# EAGLE design CubieBoardVGABreakout (EAGLE 6.5.0)
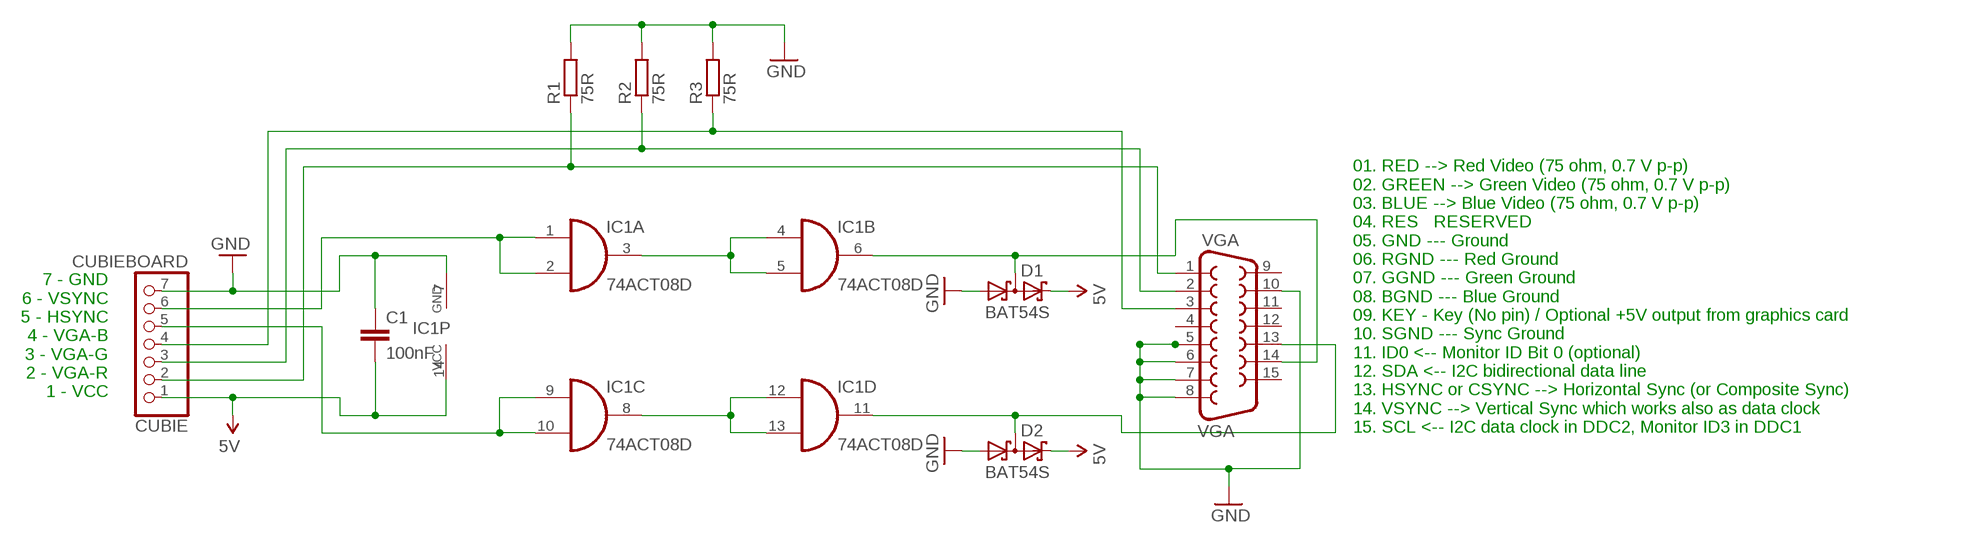
[diagram p0: schematic, sheet 1]

## Parts
C1  100nF  CAP0805  [0805]
CUBIE  CUBIEBOARD  PINHD-1X7  [1X07]
D1  BAT54S  [SOT23]
D2  BAT54S  [SOT23]
IC1  74ACT08D  [SO14]
R1  75R  R-EU_0204/2V  [0204V]
R2  75R  R-EU_0204/2V  [0204V]
R3  75R  R-EU_0204/2V  [0204V]
VGA  VGA  F15HDH  [HDF15H]

## Nets
5V: C1.2 CUBIE.1 D1.2(C2) D2.2(C2) IC1.14(P:VCC)
GND: C1.1 CUBIE.7 D1.1(A1) D2.1(A1) IC1.7(P:GND) R1.2 R2.2 R3.2 VGA.5 VGA.6 VGA.7 VGA.8 VGA.10
N$3: CUBIE.6 IC1.1(A:I0) IC1.2(A:I1)
N$4: CUBIE.5 IC1.9(C:I0) IC1.10(C:I1)
N$5: IC1.3(A:O) IC1.4(B:I0) IC1.5(B:I1)
N$6: IC1.8(C:O) IC1.12(D:I0) IC1.13(D:I1)
N$9: D2.3(C1A2) IC1.11(D:O) VGA.13
N$10: D1.3(C1A2) IC1.6(B:O) VGA.14
VGA-B: CUBIE.4 R3.1 VGA.3
VGA-G: CUBIE.3 R2.1 VGA.2
VGA-R: CUBIE.2 R1.1 VGA.1
Unconnected: VGA.4 VGA.9 VGA.11 VGA.12 VGA.15

## Notes on the sheet
- 7 - GND
  6 - VSYNC
  5 - HSYNC
  4 - VGA-B
  3 - VGA-G
  2 - VGA-R
  1 - VCC
- 01. RED --> Red Video (75 ohm, 0.7 V p-p)
  02. GREEN --> Green Video (75 ohm, 0.7 V p-p)
  03. BLUE --> Blue Video (75 ohm, 0.7 V p-p)
  04. RES   RESERVED
  05. GND --- Ground
  06. RGND --- Red Ground
  07. GGND --- Green Ground
  08. BGND --- Blue Ground
  09. KEY - Key (No pin) / Optional +5V output from graphics card
  10. SGND --- Sync Ground
  11. ID0 <-- Monitor ID Bit 0 (optional)
  12. SDA <-- I2C bidirectional data line 
  13. HSYNC or CSYNC --> Horizontal Sync (or Composite Sync)
  14. VSYNC --> Vertical Sync which works also as data clock
  15. SCL <-- I2C data clock in DDC2, Monitor ID3 in DDC1

## Library data of the parts
C1 = SparkFun-Passives:CAP: Capacitor Standard 0603 ceramic capacitor, and 0.1" leaded capacitor.
CUBIE = pinhead:PINHD-1X7: PIN HEADER
D1 D2 = diode:BAT54S: Schottky Diodes Pin connection corrected 2011-05-04 Source: Fairchild .. BAT54.pdf
IC1 = 74xx-eu:74*08: Quad 2-input AND gate
R1-R3 = resistor:R-EU_: RESISTOR, European symbol
VGA = con-subd:F15: SUB-D; OC_FARNELL: unknown; OC_NEWARK: unknown

## Net classes
0 default: clearance 0.205 mm

## Board
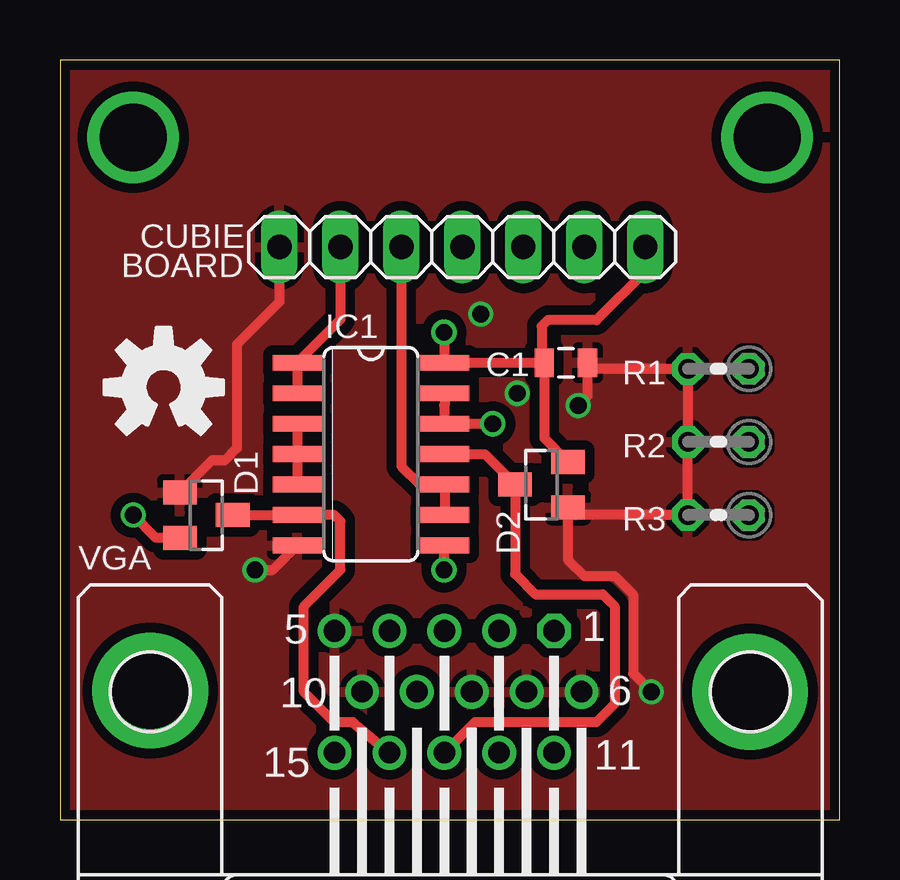
[diagram p1: board, top side]
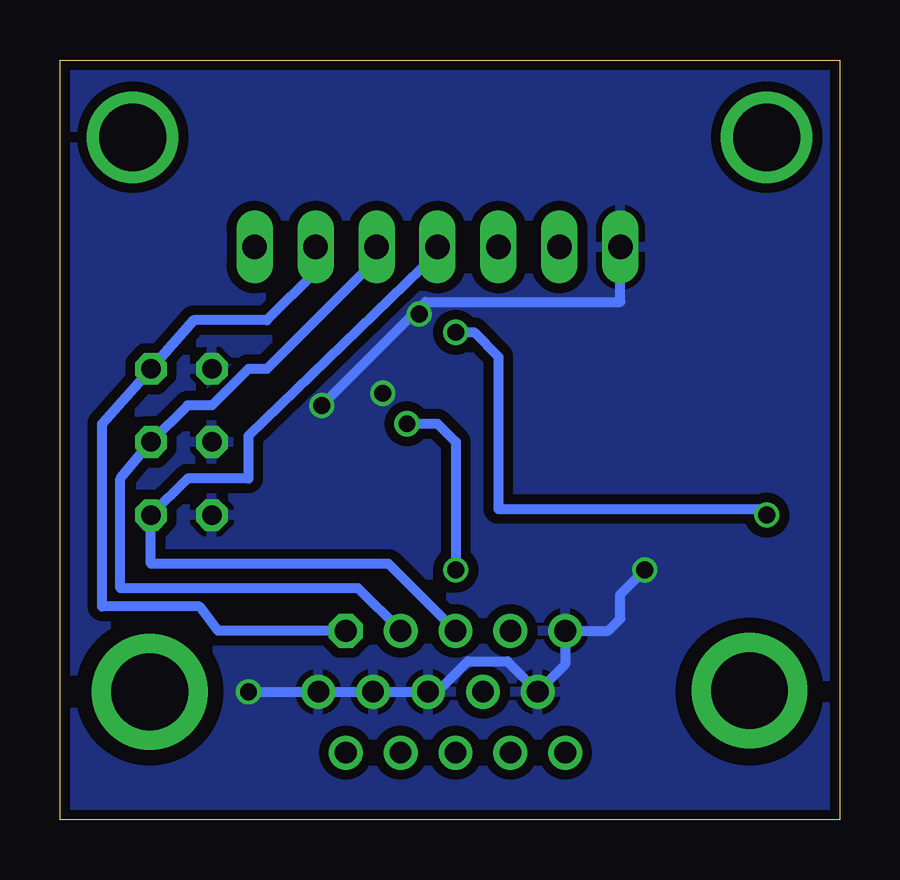
[diagram p2: board, bottom side, seen from below]

Size 32.49 x 31.67 mm. Coordinates in mm from the lower left corner, seen from the top.
Outline: 0,0 32.49,0 32.49,31.67 0,31.67 0,0
Copper layers (1*16): Top 0.035mm / dielectric 1.5mm / Bottom 0.035mm
Design rules "SeeedStudio_2layer_DRU_no_angle_20140221": minimum track width 6mil, minimum drill 12mil, track to track 6mil, track to pad 6mil, pad to pad 6mil, via to via 6mil, smd to smd 0mil, copper to edge 10mil, drill to drill 10mil, minimum pad ring 10mil, minimum via ring 6mil, stop-mask expansion 2mil, vias tented up to drill 100mil, thermal gap 10mil

### Footprints (pad centres in the part's own frame; a part is rotated, then mirrored left to right if it is on the bottom)
0805 = smd 0.8 x 1.2: 1 -0.9,0; 2 0.9,0
1X07 = drill 1.016 long: 1 -7.62,0; 2 -5.08,0; 3 -2.54,0; 4 0,0; 5 2.54,0; 6 5.08,0; 7 7.62,0
SOT23 = smd 1 x 1.4: 1 -0.95,-1.1; 2 0.95,-1.1; 3 0,1.1
SO14 = smd 0.66 x 2.032: 1 -3.81,-3.073; 2 -2.54,-3.073; 3 -1.27,-3.073; 4 0,-3.073; 5 1.27,-3.073; 6 2.54,-3.073; 7 3.81,-3.073; 8 3.81,3.073; 9 2.54,3.073; 10 1.27,3.073; 11 0,3.073; 12 -1.27,3.073; 13 -2.54,3.073; 14 -3.81,3.073
0204V = drill 0.813 octagon: 1 -1.27,0; 2 1.27,0
HDF15H = drill 0.9 octagon: 1 4.329,2.54 | drill 0.9: 2 2.043,2.54; 3 -0.243,2.54; 4 -2.529,2.54; 5 -4.815,2.54; 6 5.472,0; 7 3.186,0; 8 0.9,0; 9 -1.386,0; 10 -3.672,0; 11 4.329,-2.54; 12 2.043,-2.54; 13 -0.243,-2.54; 14 -2.529,-2.54; 15 -4.815,-2.54 | drill 3.2 pad 4.826: P$1 -12.497,0.051; P$2 12.497,0

### Placement (x,y rotation side)
C1  21.08,19.05 180 top
CUBIE  16.76,23.88 180 top
D1  6.1,12.7 270 top
D2  20.07,13.97 90 top
IC1  12.95,15.24 270 top
R1  27.43,18.8 180 top
R2  27.43,15.75 180 top
R3  27.43,12.7 180 top
U$1  [OSHW-LOGO-M]  4.32,18.03 0 top
VGA  16.26,5.33 0 top

### Tracks (layer width: path | path; a pad name or v marks a point on that pad's centre or on a via)
5V  (via drill 0.7)
  Top 0.406: C1.2 IC1.14 16.03,20.3 v16,20.32 | CUBIE.1 24.38,22.86 22.35,20.83 20.32,20.83 20.07,20.57 20.07,19.17 C1.2 | C1.2 20.18,15.9 D2.2 | D1.2 4,11.75 v3.05,12.7
  Bottom 0.406: v16,20.32 15.24,20.32 14.22,19.3 14.22,12.95 3.3,12.95 v3.05,12.7
GND  (via drill 0.7)
  Top 0.406: CUBIE.7 9.14,21.59 7.37,19.81 7.37,15.49 6.86,14.99 6.33,14.99 D1.1 | v24.64,5.33 23.88,6.1 23.88,9.4 23.11,10.16 21.84,10.16 21.17,10.84 D2.1 21.49,12.7 R3.2 R2.2 R1.2 22.24,18.8 C1.1 21.98,17.66 v21.59,17.27 | v8.13,10.41 8.87,10.41 IC1.7
  Bottom 0.406: v24.64,5.33 VGA.6 VGA.7 VGA.8 16.76,5.33 15.49,6.6 13.85,6.6 VGA.10 11.44,6.48 VGA.5 9.65,7.87 9.14,8.38 9.14,9.4 v8.13,10.41 | v21.59,17.27 17.27,21.59 9.14,21.59 CUBIE.7
  other vias: 17.53,21.08 19.05,17.78
  pour Bottom (isolate 0.406): 0,31.75 32.51,31.75 32.51,0 0,0
  pour Top (isolate 0.406): -0.76,31.5 32.51,31.5 32.51,0 -0.76,0
N$1  (via drill 2.8)
  other vias: 3.05,28.45
N$2  (via drill 2.8)
  other vias: 29.46,28.45
N$3
  Top 0.406: CUBIE.6 11.68,20.85 IC1.1 IC1.2
N$4
  Top 0.406: CUBIE.5 14.22,14.73 14.99,13.97 IC1.10 IC1.9
N$5
  Top 0.406: IC1.3 IC1.4 IC1.5
N$6  (via drill 0.7)
  Top 0.406: IC1.13 16.03,17.3 16,17.27 16,16.54 IC1.12 v18.03,16.51 | v16,10.41 16,11.4 IC1.8
  Bottom 0.406: v18.03,16.51 16.76,16.51 16,15.75 v16,10.41
N$9
  Top 0.406: IC1.11 17.7,15.24 D2.3 18.97,10.24 19.81,9.4 22.61,9.4 23.11,8.89 23.11,4.83 22.35,4.06 17.28,4.06 VGA.13
N$10
  Top 0.406: D1.3 IC1.6 11.43,12.7 11.68,12.45 11.68,10.41 10.16,8.89 10.16,5.33 11.43,4.06 12.2,4.06 VGA.14
VGA-B
  Bottom 0.406: CUBIE.4 16.76,23.62 24.64,16 24.64,14.22 27.18,14.22 R3.1 28.7,10.67 18.8,10.67 16.01,7.88 VGA.3
VGA-G
  Bottom 0.406: CUBIE.3 19.3,23.37 23.88,18.8 24.64,18.8 26.16,17.27 27.18,17.27 R2.1 29.97,14.22 29.97,9.65 20.07,9.65 18.3,7.88 VGA.2
VGA-R
  Bottom 0.406: CUBIE.2 21.84,22.86 23.88,20.83 26.92,20.83 R1.1 30.73,16.51 30.73,8.89 26.67,8.89 25.91,7.87 VGA.1

### Text on the board
tNames: BOARD
tDocu: GND | VSYN | HSYN | BLUE | GRN | RED | VCC | 7 | 1
bDocu: Cubieboard VGA Breakout | noti, 2014